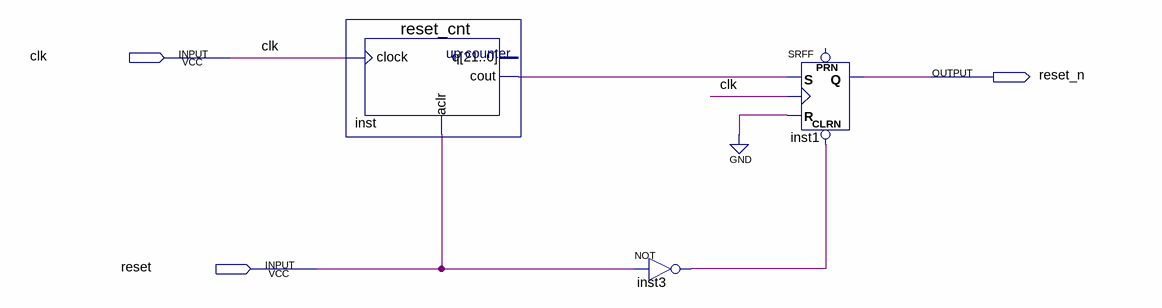
[diagram p0: schematic sheet]
// Quartus schematic start_reset.bdf as structural Verilog: 3 symbols, 3 pins
module start_reset (
  input  clk,
  input  reset,
  output reset_n
);

  wire inst3_out, inst_cout;

  reset_cnt inst (.clock(clk), .aclr(reset), .cout(inst_cout));  // open: q
  not inst3 (inst3_out, reset);
  SRFF inst1 (.CLRN(inst3_out), .S(inst_cout), .R(1'b0), .CLK(clk), .Q(reset_n));  // open: PRN
endmodule
